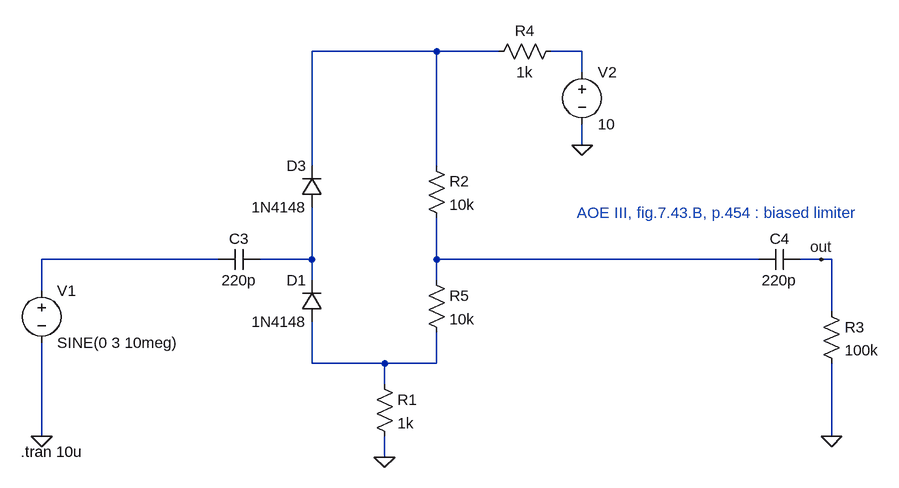
[diagram p0: schematic biased_limiter.asc]
biased_limiter.asc, the LTspice schematic file:
Version 4
SHEET 1 880 680
WIRE 96 -224 -96 -224
WIRE 192 -224 96 -224
WIRE 320 -224 272 -224
WIRE 320 -192 320 -224
WIRE 320 -80 320 -112
WIRE -96 -48 -96 -224
WIRE 96 -48 96 -224
WIRE -240 96 -512 96
WIRE -96 96 -96 16
WIRE -96 96 -176 96
WIRE 96 96 96 32
WIRE 592 96 96 96
WIRE 688 96 656 96
WIRE 704 96 688 96
WIRE -96 128 -96 96
WIRE 96 128 96 96
WIRE -512 144 -512 96
WIRE 704 176 704 96
WIRE -96 256 -96 192
WIRE 16 256 -96 256
WIRE 96 256 96 208
WIRE 96 256 16 256
WIRE 16 288 16 256
WIRE -512 368 -512 224
WIRE 704 368 704 256
WIRE 16 400 16 368
FLAG -512 368 0
FLAG 16 400 0
FLAG 704 368 0
FLAG 320 -80 0
FLAG 688 96 out
SYMBOL diode -80 192 R180
WINDOW 0 24 64 Left 2
WINDOW 3 24 0 Left 2
SYMATTR InstName D1
SYMATTR Value 1N4148
SYMBOL cap -176 80 R90
WINDOW 0 0 32 VBottom 2
WINDOW 3 32 32 VTop 2
SYMATTR InstName C3
SYMATTR Value 220p
SYMBOL cap 656 80 R90
WINDOW 0 0 32 VBottom 2
WINDOW 3 32 32 VTop 2
SYMATTR InstName C4
SYMATTR Value 220p
SYMBOL res 688 160 R0
SYMATTR InstName R3
SYMATTR Value 100k
SYMBOL voltage -512 128 R0
WINDOW 123 0 0 Left 0
WINDOW 39 0 0 Left 0
SYMATTR InstName V1
SYMATTR Value SINE(0 3 10meg)
SYMBOL res 288 -240 R90
WINDOW 0 0 56 VBottom 2
WINDOW 3 32 56 VTop 2
SYMATTR InstName R4
SYMATTR Value 1k
SYMBOL voltage 320 -208 R0
SYMATTR InstName V2
SYMATTR Value 10
SYMBOL diode -80 16 R180
WINDOW 0 24 64 Left 2
WINDOW 3 24 0 Left 2
SYMATTR InstName D3
SYMATTR Value 1N4148
SYMBOL res 0 272 R0
SYMATTR InstName R1
SYMATTR Value 1k
SYMBOL res 80 -64 R0
SYMATTR InstName R2
SYMATTR Value 10k
SYMBOL res 80 112 R0
SYMATTR InstName R5
SYMATTR Value 10k
TEXT -544 392 Left 2 !.tran 10u
TEXT 312 24 Left 2 ;AOE III, fig.7.43.B, p.454 : biased limiter

The netlist it stands for:
* biased_limiter.asc
D1 N006 N004 1N4148
C3 N004 N003 220p
C4 out N005 220p
R3 out 0 100k
V1 N003 0 SINE(0 3 10meg)
R4 N002 N001 1k
V2 N002 0 10
D3 N004 N001 1N4148
R1 N006 0 1k
R2 N001 N005 10k
R5 N005 N006 10k
.model D D
.lib standard.dio
.tran 10u
* AOE III, fig.7.43.B, p.454 : biased limiter
.backanno
.end